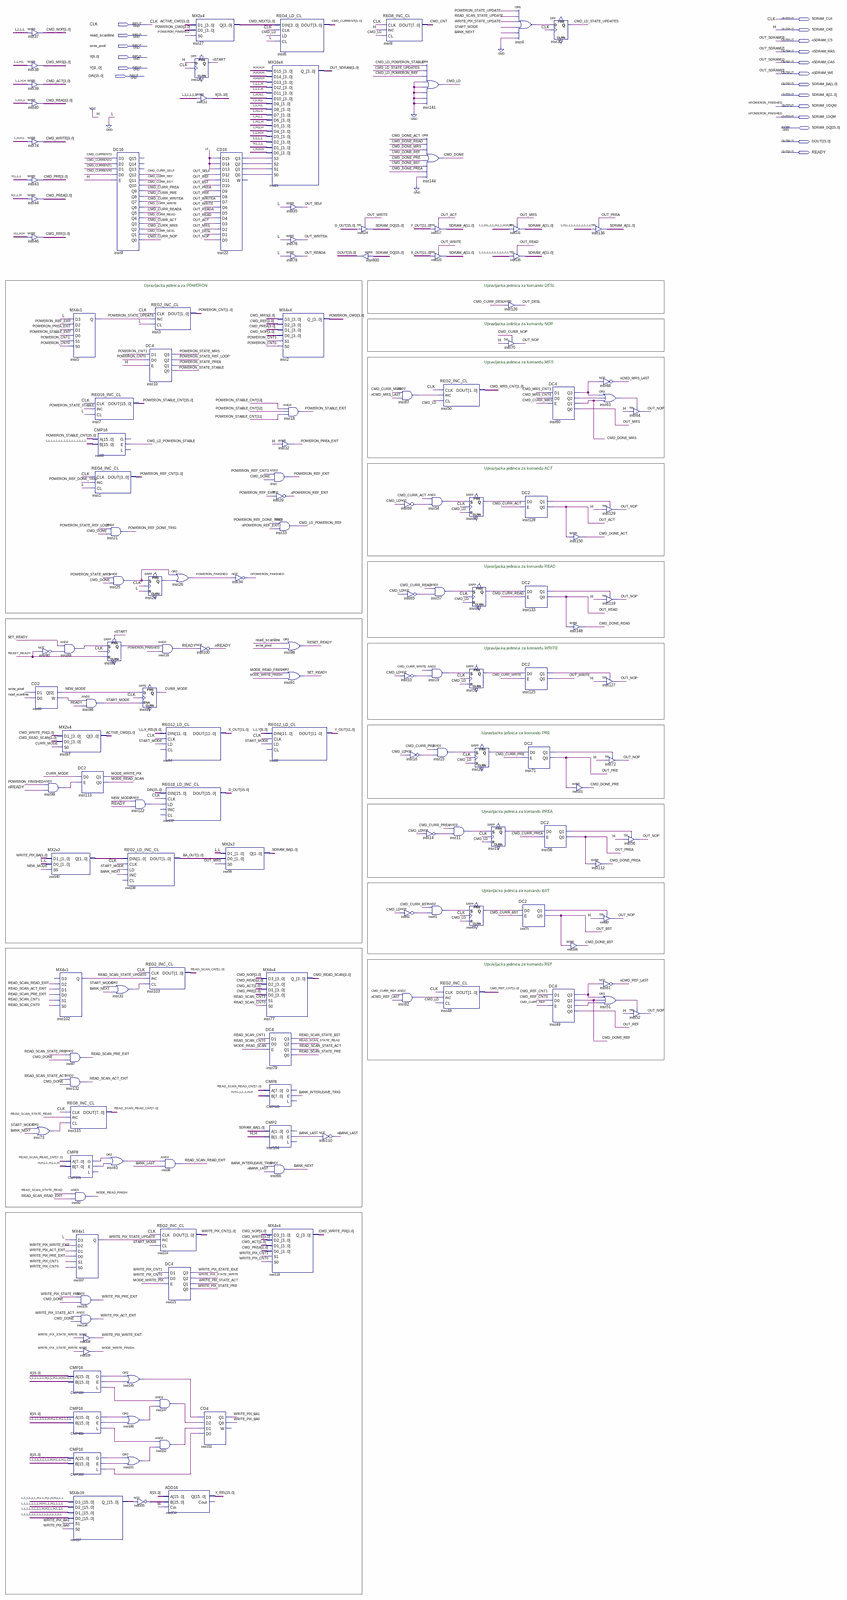
[diagram p0: schematic sheet, whole]
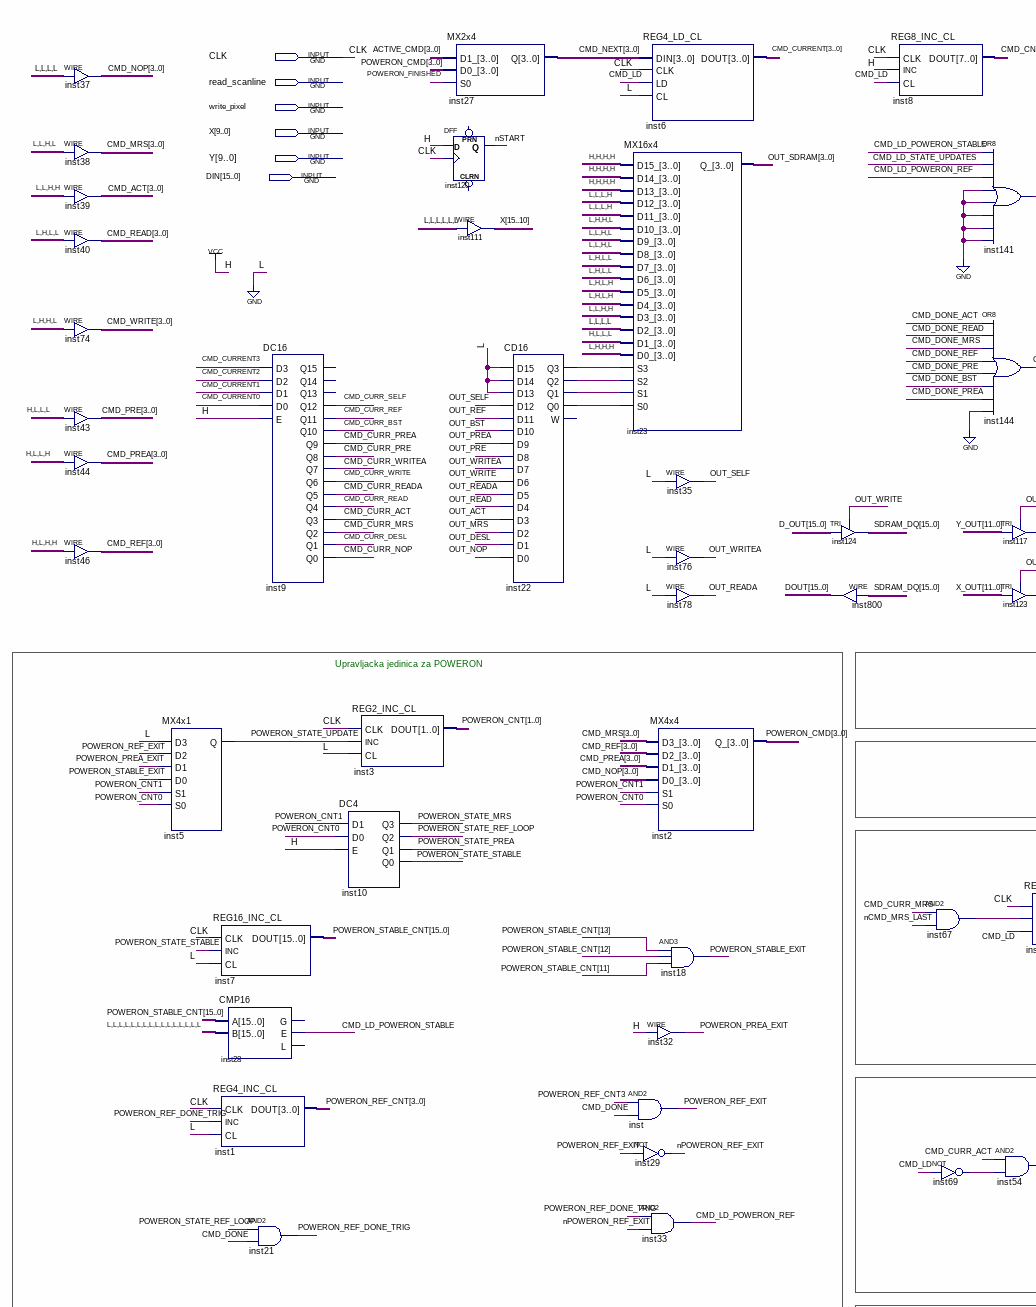
[diagram p1: schematic sheet, upper left part]
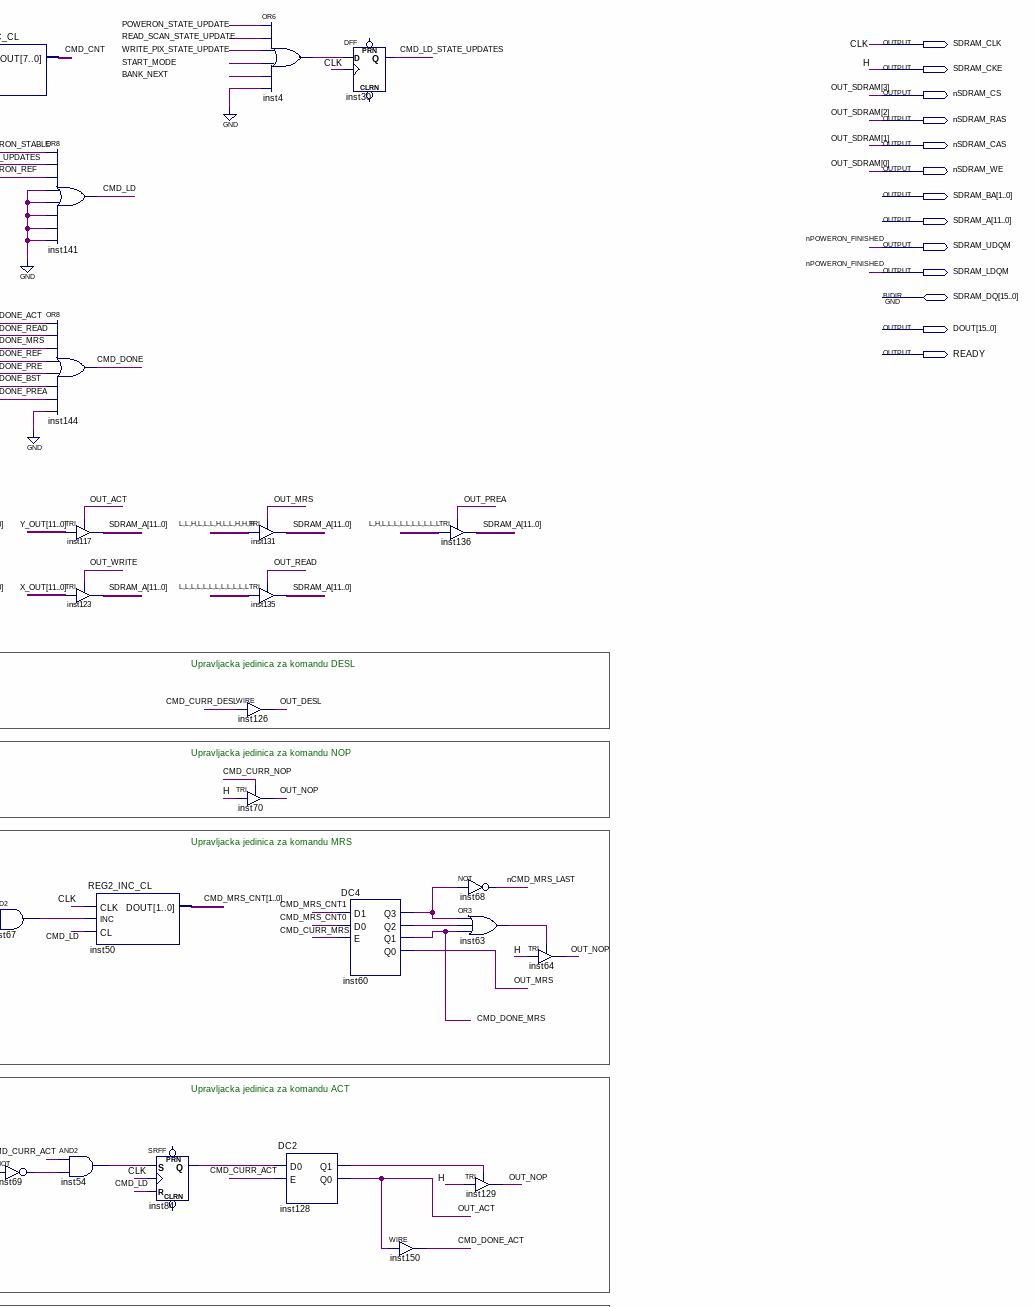
[diagram p2: schematic sheet, upper right part]
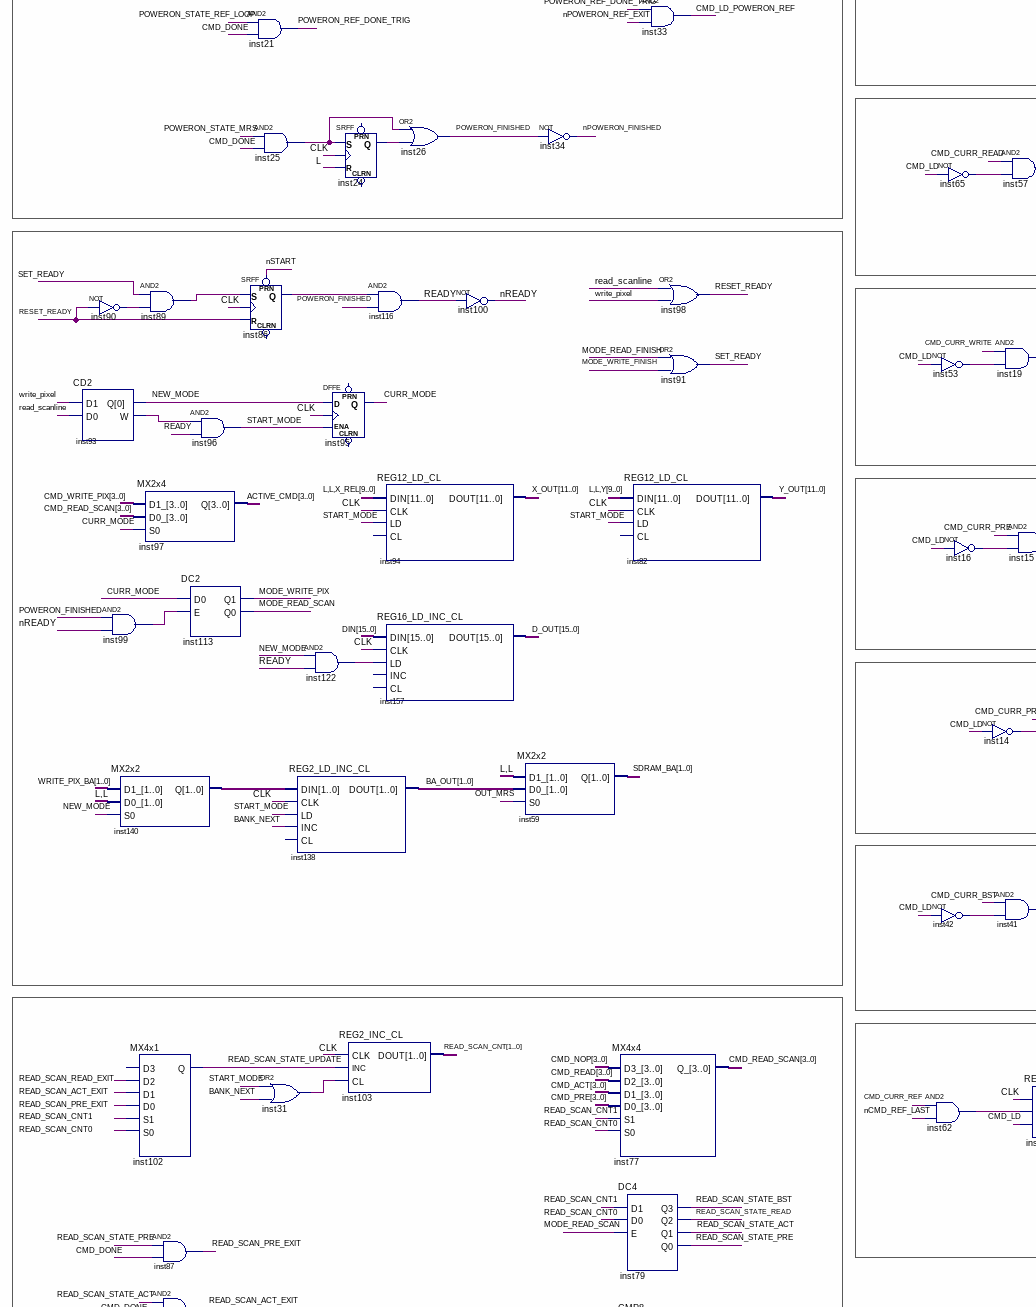
[diagram p3: schematic sheet, middle left part]
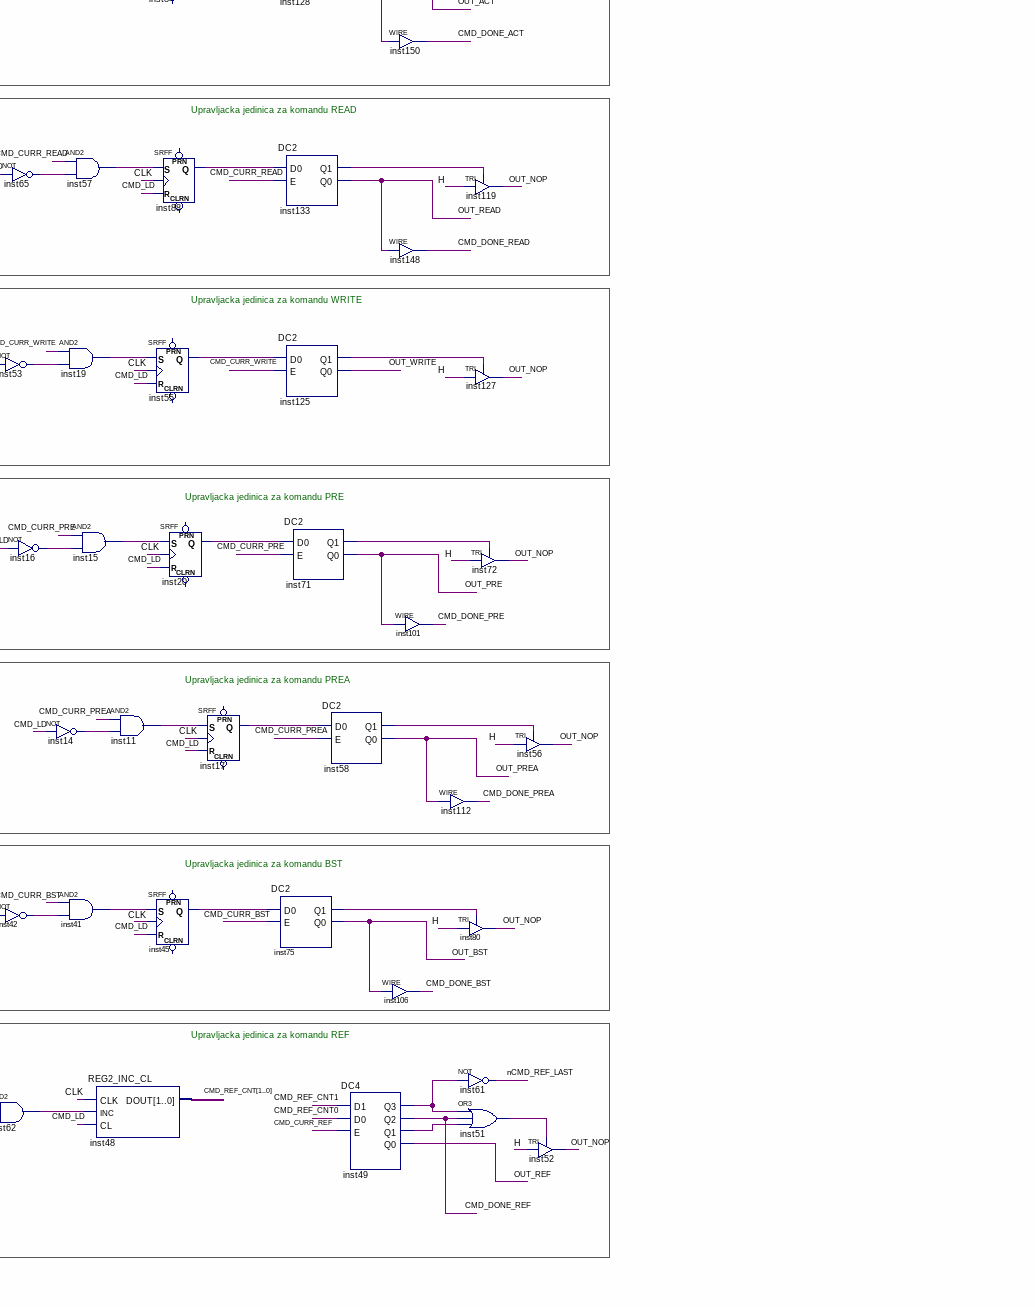
[diagram p4: schematic sheet, middle right part]
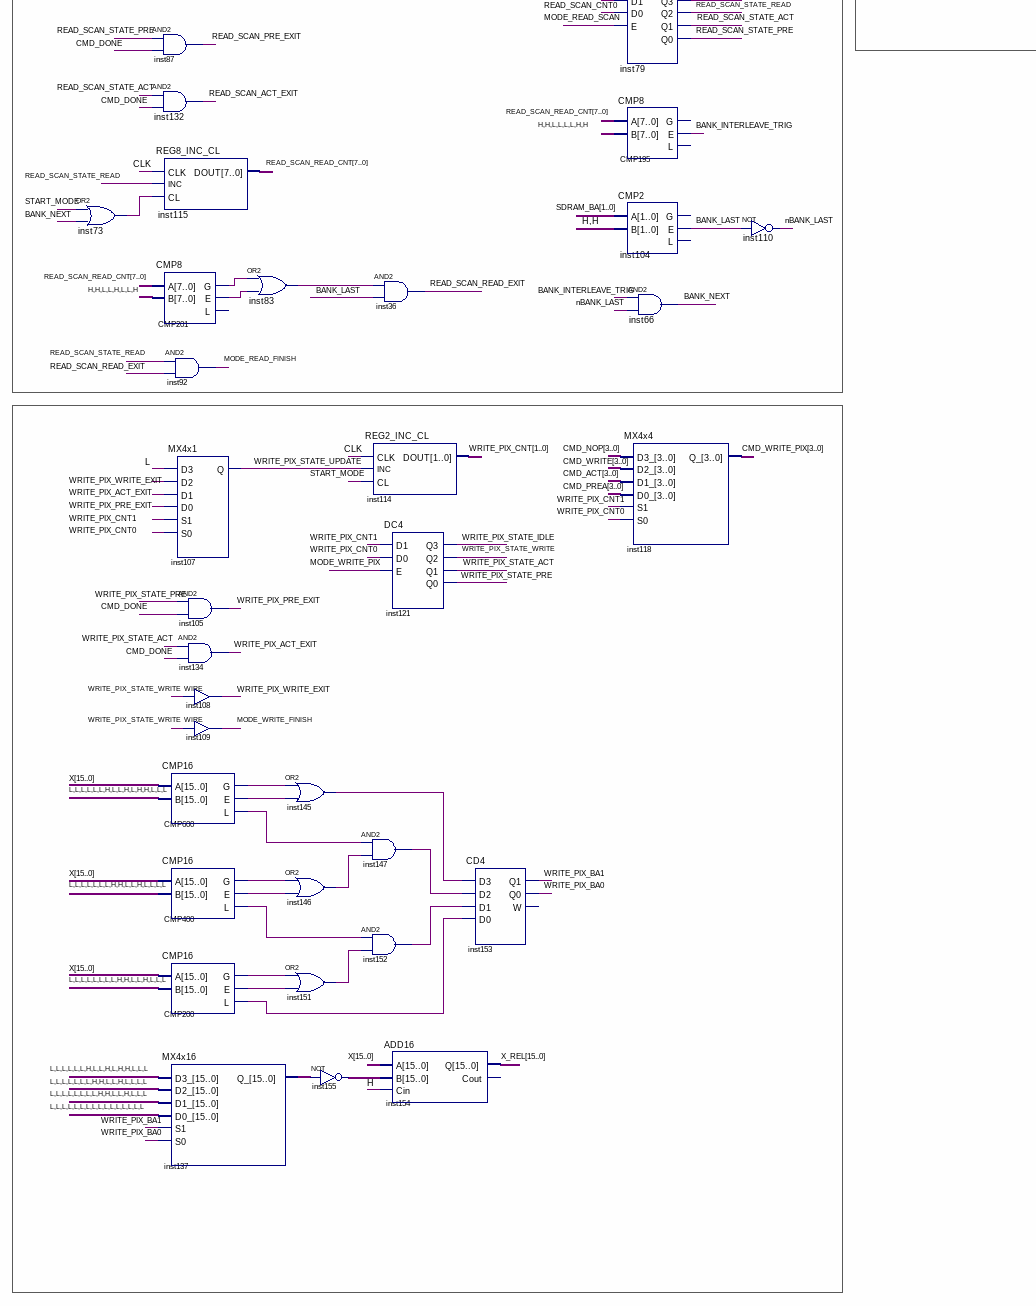
[diagram p5: schematic sheet, lower left part]
// Quartus schematic vram_controller.bdf as structural Verilog: 153 symbols, 19 pins
module vram_controller (
  input  CLK,
  input  read_scanline,
  input  write_pixel,
  input  [15:0] X,
  input  [9:0] Y,
  input  [15:0] DIN,
  inout  [15:0] SDRAM_DQ,
  output SDRAM_CLK,
  output SDRAM_CKE,
  output nSDRAM_CS,
  output nSDRAM_RAS,
  output nSDRAM_CAS,
  output nSDRAM_WE,
  output [1:0] SDRAM_BA,
  output [11:0] SDRAM_A,
  output SDRAM_UDQM,
  output SDRAM_LDQM,
  output [15:0] DOUT,
  output READY
);

  wire BANK_INTERLEAVE_TRIG, BANK_LAST, BANK_NEXT, CMD_CNT, CMD_CURR_ACT, CMD_CURR_BST, CMD_CURR_DESL,
       CMD_CURR_MRS, CMD_CURR_NOP, CMD_CURR_PRE, CMD_CURR_PREA, CMD_CURR_READ, CMD_CURR_READA, CMD_CURR_REF,
       CMD_CURR_SELF, CMD_CURR_WRITE, CMD_CURR_WRITEA, CMD_DONE, CMD_DONE_ACT, CMD_DONE_BST, CMD_DONE_MRS,
       CMD_DONE_PRE, CMD_DONE_PREA, CMD_DONE_READ, CMD_DONE_REF, CMD_LD, CMD_LD_POWERON_REF,
       CMD_LD_POWERON_STABLE, CMD_LD_STATE_UPDATES, CMP200_e, CMP200_g, CMP200_l, CMP201_e, CMP201_g,
       CMP400_e, CMP400_g, CMP400_l, CMP600_e, CMP600_g, CMP600_l, CURR_MODE, inst4_out, inst11_out,
       inst14_out, inst15_out, inst16_out, inst17_q, inst19_out, inst20_q, inst22_q0, inst22_q1, inst22_q2,
       inst22_q3, inst24_q, inst25_out, inst31_out, inst41_out, inst42_out, inst45_q, inst49_q1, inst49_q3,
       inst51_out, inst53_out, inst54_out, inst55_q, inst57_out, inst58_q1, inst60_q2, inst60_q3, inst62_out,
       inst63_out, inst65_out, inst67_out, inst69_out, inst71_q1, inst73_out, inst75_q1, inst83_out,
       inst84_q, inst86_q, inst88_q, inst89_out, inst90_out, inst93_w, inst99_out, inst122_out, inst125_q1,
       inst128_q1, inst133_q1, inst145_out, inst146_out, inst147_out, inst151_out, inst152_out,
       MODE_READ_FINISH, MODE_READ_SCAN, MODE_WRITE_FINISH, MODE_WRITE_PIX, nBANK_LAST, nCMD_MRS_LAST,
       nCMD_REF_LAST, NEW_MODE, nPOWERON_REF_EXIT, nREADY, nSTART, OUT_ACT, OUT_BST, OUT_DESL, OUT_MRS,
       OUT_NOP, OUT_PRE, OUT_PREA, OUT_READ, OUT_READA, OUT_REF, OUT_SELF, OUT_WRITE, OUT_WRITEA,
       POWERON_FINISHED, POWERON_PREA_EXIT, POWERON_REF_DONE_TRIG, POWERON_REF_EXIT, POWERON_STABLE_EXIT,
       POWERON_STATE_MRS, POWERON_STATE_PREA, POWERON_STATE_REF_LOOP, POWERON_STATE_STABLE,
       POWERON_STATE_UPDATE, READ_SCAN_ACT_EXIT, READ_SCAN_PRE_EXIT, READ_SCAN_READ_EXIT,
       READ_SCAN_STATE_ACT, READ_SCAN_STATE_BST, READ_SCAN_STATE_PRE, READ_SCAN_STATE_READ,
       READ_SCAN_STATE_UPDATE, RESET_READY, SET_READY, START_MODE, WRITE_PIX_ACT_EXIT, WRITE_PIX_PRE_EXIT,
       WRITE_PIX_STATE_ACT, WRITE_PIX_STATE_IDLE, WRITE_PIX_STATE_PRE, WRITE_PIX_STATE_UPDATE,
       WRITE_PIX_STATE_WRITE, WRITE_PIX_WRITE_EXIT;
  wire [1:0] BA_OUT, CMD_MRS_CNT, CMD_REF_CNT, inst140_q, POWERON_CNT, READ_SCAN_CNT, WRITE_PIX_BA,
       WRITE_PIX_CNT;
  wire [3:0] ACTIVE_CMD, CMD_ACT, CMD_CURRENT, CMD_MRS, CMD_NEXT, CMD_NOP, CMD_PRE, CMD_PREA, CMD_READ,
       CMD_READ_SCAN, CMD_REF, CMD_WRITE, CMD_WRITE_PIX, POWERON_CMD, POWERON_REF_CNT;
  wire [7:0] READ_SCAN_READ_CNT;
  wire [11:0] X_OUT, Y_OUT;
  wire [15:0] D_OUT, inst137_q_, inst155_out, POWERON_STABLE_CNT, X_REL;

  assign CMD_NOP = 4'b0000;  // WIRE inst37
  assign CMD_MRS = 4'b0010;  // WIRE inst38
  assign CMD_ACT = 4'b0011;  // WIRE inst39
  assign CMD_READ = 4'b0100;  // WIRE inst40
  assign CMD_WRITE = 4'b0110;  // WIRE inst74
  assign CMD_PRE = 4'b1000;  // WIRE inst43
  assign CMD_PREA = 4'b1001;  // WIRE inst44
  assign CMD_REF = 4'b1011;  // WIRE inst46
  not inst90 (inst90_out, RESET_READY);
  CD2 inst93 (.D1(write_pixel), .D0(read_scanline), .Q(NEW_MODE), .W(inst93_w));
  and inst99 (inst99_out, POWERON_FINISHED, nREADY);
  MX2x2 inst140 (.D1_(WRITE_PIX_BA), .D0_(2'b00), .S0(NEW_MODE), .Q(inst140_q));
  or inst73 (inst73_out, START_MODE, BANK_NEXT);
  MX4x1 inst5 (
    .D3(1'b0), .D2(POWERON_REF_EXIT), .D1(POWERON_PREA_EXIT), .D0(POWERON_STABLE_EXIT), .S1(POWERON_CNT[1]),
    .S0(POWERON_CNT[0]), .Q(POWERON_STATE_UPDATE));
  and inst89 (inst89_out, SET_READY, inst90_out);
  MX2x4 inst97 (.D1_(CMD_WRITE_PIX), .D0_(CMD_READ_SCAN), .S0(CURR_MODE), .Q(ACTIVE_CMD));
  MX4x1 inst102 (
    .D2(READ_SCAN_READ_EXIT), .D1(READ_SCAN_ACT_EXIT), .D0(READ_SCAN_PRE_EXIT), .S1(READ_SCAN_CNT[1]),
    .S0(READ_SCAN_CNT[0]), .Q(READ_SCAN_STATE_UPDATE));  // open: D3
  and inst87 (READ_SCAN_PRE_EXIT, READ_SCAN_STATE_PRE, CMD_DONE);
  and inst132 (READ_SCAN_ACT_EXIT, READ_SCAN_STATE_ACT, CMD_DONE);
  REG8_INC_CL inst115 (.CLK(CLK), .INC(READ_SCAN_STATE_READ), .CL(inst73_out), .DOUT(READ_SCAN_READ_CNT));
  CMP8 CMP201 (.A(READ_SCAN_READ_CNT), .B(8'b11001001), .G(CMP201_g), .E(CMP201_e));  // open: L
  CMP16 CMP600 (.A(X), .B(16'b0000001001011000), .G(CMP600_g), .E(CMP600_e), .L(CMP600_l));
  CMP16 CMP400 (.A(X), .B(16'b0000000110010000), .G(CMP400_g), .E(CMP400_e), .L(CMP400_l));
  CMP16 CMP200 (.A(X), .B(16'b0000000011001000), .G(CMP200_g), .E(CMP200_e), .L(CMP200_l));
  MX4x16 inst137 (
    .D3_(16'b0000001001011000), .D2_(16'b0000000110010000), .D1_(16'b0000000011001000), .D0_({16{1'b0}}),
    .S1(WRITE_PIX_BA[1]), .S0(WRITE_PIX_BA[0]), .Q_(inst137_q_));
  REG16_INC_CL inst7 (.CLK(CLK), .INC(POWERON_STATE_STABLE), .CL(1'b0), .DOUT(POWERON_STABLE_CNT));
  REG4_INC_CL inst1 (.CLK(CLK), .INC(POWERON_REF_DONE_TRIG), .CL(1'b0), .DOUT(POWERON_REF_CNT));
  and inst96 (START_MODE, inst93_w, READY);
  DC2 inst113 (.D0(CURR_MODE), .E(inst99_out), .Q1(MODE_WRITE_PIX), .Q0(MODE_READ_SCAN));
  and inst92 (MODE_READ_FINISH, READ_SCAN_STATE_READ, READ_SCAN_READ_EXIT);
  MX4x1 inst107 (
    .D3(1'b0), .D2(WRITE_PIX_WRITE_EXIT), .D1(WRITE_PIX_ACT_EXIT), .D0(WRITE_PIX_PRE_EXIT),
    .S1(WRITE_PIX_CNT[1]), .S0(WRITE_PIX_CNT[0]), .Q(WRITE_PIX_STATE_UPDATE));
  and inst105 (WRITE_PIX_PRE_EXIT, WRITE_PIX_STATE_PRE, CMD_DONE);
  and inst134 (WRITE_PIX_ACT_EXIT, WRITE_PIX_STATE_ACT, CMD_DONE);
  assign WRITE_PIX_WRITE_EXIT = WRITE_PIX_STATE_WRITE;  // WIRE inst108
  assign MODE_WRITE_FINISH = WRITE_PIX_STATE_WRITE;  // WIRE inst109
  DC16 inst9 (
    .D3(CMD_CURRENT[3]), .D2(CMD_CURRENT[2]), .D1(CMD_CURRENT[1]), .D0(CMD_CURRENT[0]), .E(1'b1),
    .Q12(CMD_CURR_SELF), .Q11(CMD_CURR_REF), .Q10(CMD_CURR_BST), .Q9(CMD_CURR_PREA), .Q8(CMD_CURR_PRE),
    .Q7(CMD_CURR_WRITEA), .Q6(CMD_CURR_WRITE), .Q5(CMD_CURR_READA), .Q4(CMD_CURR_READ), .Q3(CMD_CURR_ACT),
    .Q2(CMD_CURR_MRS), .Q1(CMD_CURR_DESL), .Q0(CMD_CURR_NOP));  // open: Q15, Q14, Q13
  CMP16 inst28 (.A(POWERON_STABLE_CNT), .B({16{1'b0}}), .E(CMD_LD_POWERON_STABLE));  // open: G, L
  and inst21 (POWERON_REF_DONE_TRIG, POWERON_STATE_REF_LOOP, CMD_DONE);
  and inst25 (inst25_out, POWERON_STATE_MRS, CMD_DONE);
  SRFF inst86 (.PRN(nSTART), .S(inst89_out), .R(RESET_READY), .CLK(CLK), .Q(inst86_q));  // open: CLRN
  or inst31 (inst31_out, START_MODE, BANK_NEXT);
  or inst83 (inst83_out, CMP201_g, CMP201_e);
  and inst122 (inst122_out, NEW_MODE, READY);
  REG2_LD_INC_CL inst138 (.DIN(inst140_q), .CLK(CLK), .LD(START_MODE), .INC(BANK_NEXT), .DOUT(BA_OUT));  // open: CL
  or inst145 (inst145_out, CMP600_g, CMP600_e);
  or inst146 (inst146_out, CMP400_g, CMP400_e);
  or inst151 (inst151_out, CMP200_g, CMP200_e);
  assign inst155_out = ~inst137_q_;  // NOT inst155, 16 bits wide
  REG2_INC_CL inst3 (.CLK(CLK), .INC(POWERON_STATE_UPDATE), .CL(1'b0), .DOUT(POWERON_CNT));
  DC4 inst10 (
    .D1(POWERON_CNT[1]), .D0(POWERON_CNT[0]), .E(1'b1), .Q3(POWERON_STATE_MRS), .Q2(POWERON_STATE_REF_LOOP),
    .Q1(POWERON_STATE_PREA), .Q0(POWERON_STATE_STABLE));
  SRFF inst24 (.S(inst25_out), .R(1'b0), .CLK(CLK), .Q(inst24_q));  // open: PRN, CLRN
  DFFE inst95 (.D(NEW_MODE), .CLK(CLK), .ENA(START_MODE), .Q(CURR_MODE));  // open: PRN, CLRN
  REG2_INC_CL inst103 (.CLK(CLK), .INC(READ_SCAN_STATE_UPDATE), .CL(inst31_out), .DOUT(READ_SCAN_CNT));
  REG2_INC_CL inst114 (.CLK(CLK), .INC(WRITE_PIX_STATE_UPDATE), .CL(START_MODE), .DOUT(WRITE_PIX_CNT));
  and inst147 (inst147_out, CMP600_l, inst146_out);
  and inst152 (inst152_out, CMP400_l, inst151_out);
  or inst26 (POWERON_FINISHED, inst25_out, inst24_q);
  and inst116 (READY, inst86_q, POWERON_FINISHED);
  REG12_LD_CL inst94 (.DIN({2'b00, X_REL[9:0]}), .CLK(CLK), .LD(START_MODE), .DOUT(X_OUT));  // open: CL
  REG16_LD_INC_CL inst157 (.DIN(DIN), .CLK(CLK), .LD(inst122_out), .DOUT(D_OUT));  // open: INC, CL
  and inst36 (READ_SCAN_READ_EXIT, inst83_out, BANK_LAST);
  DC4 inst121 (
    .D1(WRITE_PIX_CNT[1]), .D0(WRITE_PIX_CNT[0]), .E(MODE_WRITE_PIX), .Q3(WRITE_PIX_STATE_IDLE),
    .Q2(WRITE_PIX_STATE_WRITE), .Q1(WRITE_PIX_STATE_ACT), .Q0(WRITE_PIX_STATE_PRE));
  ADD16 inst154 (.A(X), .B(inst155_out), .Cin(1'b1), .Q(X_REL));  // open: Cout
  MX2x4 inst27 (.D1_(ACTIVE_CMD), .D0_(POWERON_CMD), .S0(POWERON_FINISHED), .Q(CMD_NEXT));
  DFF inst120 (.CLK(CLK), .D(1'b1), .Q(nSTART));  // open: CLRN, PRN
  assign X[15:10] = {6{1'b0}};  // WIRE inst111
  not inst100 (nREADY, READY);
  CD4 inst153 (
    .D3(inst145_out), .D2(inst147_out), .D1(inst152_out), .D0(CMP200_l), .Q1(WRITE_PIX_BA[1]),
    .Q0(WRITE_PIX_BA[0]));  // open: W
  CD16 inst22 (
    .D15(1'b0), .D14(1'b0), .D13(1'b0), .D12(OUT_SELF), .D11(OUT_REF), .D10(OUT_BST), .D9(OUT_PREA),
    .D8(OUT_PRE), .D7(OUT_WRITEA), .D6(OUT_WRITE), .D5(OUT_READA), .D4(OUT_READ), .D3(OUT_ACT), .D2(OUT_MRS),
    .D1(OUT_DESL), .D0(OUT_NOP), .Q3(inst22_q3), .Q2(inst22_q2), .Q1(inst22_q1), .Q0(inst22_q0));  // open: W
  MX2x2 inst59 (.D1_(2'b00), .D0_(BA_OUT), .S0(OUT_MRS), .Q(SDRAM_BA));
  not inst34 (SDRAM_LDQM, POWERON_FINISHED);
  MX4x4 inst77 (
    .D3_(CMD_NOP), .D2_(CMD_READ), .D1_(CMD_ACT), .D0_(CMD_PRE), .S1(READ_SCAN_CNT[1]),
    .S0(READ_SCAN_CNT[0]), .Q_(CMD_READ_SCAN));
  DC4 inst79 (
    .D1(READ_SCAN_CNT[1]), .D0(READ_SCAN_CNT[0]), .E(MODE_READ_SCAN), .Q3(READ_SCAN_STATE_BST),
    .Q2(READ_SCAN_STATE_READ), .Q1(READ_SCAN_STATE_ACT), .Q0(READ_SCAN_STATE_PRE));
  CMP8 CMP195 (.A(READ_SCAN_READ_CNT), .B(8'b11000011), .E(BANK_INTERLEAVE_TRIG));  // open: G, L
  CMP2 inst104 (.A(SDRAM_BA), .B(2'b11), .E(BANK_LAST));  // open: G, L
  REG4_LD_CL inst6 (.DIN(CMD_NEXT), .CLK(CLK), .LD(CMD_LD), .CL(1'b0), .DOUT(CMD_CURRENT));
  MX16x4 inst23 (
    .D15_(4'b1111), .D14_(4'b1111), .D13_(4'b1111), .D12_(4'b0001), .D11_(4'b0001), .D10_(4'b0110),
    .D9_(4'b0010), .D8_(4'b0010), .D7_(4'b0100), .D6_(4'b0100), .D5_(4'b0101), .D4_(4'b0101), .D3_(4'b0011),
    .D2_(4'b0000), .D1_(4'b1000), .D0_(4'b0111), .S3(inst22_q3), .S2(inst22_q2), .S1(inst22_q1),
    .S0(inst22_q0), .Q_({nSDRAM_CS, nSDRAM_RAS, nSDRAM_CAS, nSDRAM_WE}));
  assign OUT_SELF = 1'b0;  // WIRE inst35
  assign OUT_WRITEA = 1'b0;  // WIRE inst76
  assign OUT_READA = 1'b0;  // WIRE inst78
  MX4x4 inst2 (
    .D3_(CMD_MRS), .D2_(CMD_REF), .D1_(CMD_PREA), .D0_(CMD_NOP), .S1(POWERON_CNT[1]), .S0(POWERON_CNT[0]),
    .Q_(POWERON_CMD));
  and inst18 (POWERON_STABLE_EXIT, POWERON_STABLE_CNT[13], POWERON_STABLE_CNT[12], POWERON_STABLE_CNT[11]);
  assign POWERON_PREA_EXIT = 1'b1;  // WIRE inst32
  and inst (POWERON_REF_EXIT, POWERON_REF_CNT[3], CMD_DONE);
  not inst29 (nPOWERON_REF_EXIT, POWERON_REF_EXIT);
  and inst33 (CMD_LD_POWERON_REF, POWERON_REF_DONE_TRIG, nPOWERON_REF_EXIT);
  or inst98 (RESET_READY, read_scanline, write_pixel);
  or inst91 (SET_READY, MODE_READ_FINISH, MODE_WRITE_FINISH);
  REG12_LD_CL inst82 (.DIN({2'b00, Y}), .CLK(CLK), .LD(START_MODE), .DOUT(Y_OUT));  // open: CL
  and inst66 (BANK_NEXT, BANK_INTERLEAVE_TRIG, nBANK_LAST);
  MX4x4 inst118 (
    .D3_(CMD_NOP), .D2_(CMD_WRITE), .D1_(CMD_ACT), .D0_(CMD_PREA), .S1(WRITE_PIX_CNT[1]),
    .S0(WRITE_PIX_CNT[0]), .Q_(CMD_WRITE_PIX));
  not inst110 (nBANK_LAST, BANK_LAST);
  TRI inst124[15:0] (.IN(D_OUT), .OE(OUT_WRITE), .OUT(SDRAM_DQ));
  assign DOUT = SDRAM_DQ;  // WIRE inst800
  REG8_INC_CL inst8 (.CLK(CLK), .INC(1'b1), .CL(CMD_LD), .DOUT(CMD_CNT));
  and inst67 (inst67_out, CMD_CURR_MRS, nCMD_MRS_LAST);
  not inst69 (inst69_out, CMD_LD);
  not inst65 (inst65_out, CMD_LD);
  not inst53 (inst53_out, CMD_LD);
  not inst16 (inst16_out, CMD_LD);
  not inst42 (inst42_out, CMD_LD);
  and inst62 (inst62_out, CMD_CURR_REF, nCMD_REF_LAST);
  or inst141 (CMD_LD, CMD_LD_POWERON_STABLE, CMD_LD_STATE_UPDATES, CMD_LD_POWERON_REF, 1'b0, 1'b0, 1'b0, 1'b0, 1'b0);
  or inst144 (CMD_DONE, CMD_DONE_ACT, CMD_DONE_READ, CMD_DONE_MRS, CMD_DONE_REF, CMD_DONE_PRE, CMD_DONE_BST, CMD_DONE_PREA, 1'b0);
  TRI inst117[11:0] (.IN(Y_OUT), .OE(OUT_ACT), .OUT(SDRAM_A));
  TRI inst123[11:0] (.IN(X_OUT), .OE(OUT_WRITE), .OUT(SDRAM_A));
  REG2_INC_CL inst50 (.CLK(CLK), .INC(inst67_out), .CL(CMD_LD), .DOUT(CMD_MRS_CNT));
  and inst54 (inst54_out, CMD_CURR_ACT, inst69_out);
  and inst57 (inst57_out, CMD_CURR_READ, inst65_out);
  and inst19 (inst19_out, CMD_CURR_WRITE, inst53_out);
  and inst15 (inst15_out, CMD_CURR_PRE, inst16_out);
  not inst14 (inst14_out, CMD_LD);
  and inst41 (inst41_out, CMD_CURR_BST, inst42_out);
  REG2_INC_CL inst48 (.CLK(CLK), .INC(inst62_out), .CL(CMD_LD), .DOUT(CMD_REF_CNT));
  and inst11 (inst11_out, CMD_CURR_PREA, inst14_out);
  SRFF inst84 (.S(inst54_out), .R(CMD_LD), .CLK(CLK), .Q(inst84_q));  // open: PRN, CLRN
  SRFF inst88 (.S(inst57_out), .R(CMD_LD), .CLK(CLK), .Q(inst88_q));  // open: PRN, CLRN
  SRFF inst55 (.S(inst19_out), .R(CMD_LD), .CLK(CLK), .Q(inst55_q));  // open: PRN, CLRN
  SRFF inst20 (.S(inst15_out), .R(CMD_LD), .CLK(CLK), .Q(inst20_q));  // open: PRN, CLRN
  SRFF inst45 (.S(inst41_out), .R(CMD_LD), .CLK(CLK), .Q(inst45_q));  // open: PRN, CLRN
  assign OUT_DESL = CMD_CURR_DESL;  // WIRE inst126
  TRI inst70 (.IN(1'b1), .OE(CMD_CURR_NOP), .OUT(OUT_NOP));
  SRFF inst17 (.S(inst11_out), .R(CMD_LD), .CLK(CLK), .Q(inst17_q));  // open: PRN, CLRN
  or inst4 (inst4_out, POWERON_STATE_UPDATE, READ_SCAN_STATE_UPDATE, WRITE_PIX_STATE_UPDATE, START_MODE, BANK_NEXT, 1'b0);
  TRI inst131[11:0] (.IN(12'b001000100111), .OE(OUT_MRS), .OUT(SDRAM_A));
  TRI inst135[11:0] (.IN({12{1'b0}}), .OE(OUT_READ), .OUT(SDRAM_A));
  DC2 inst128 (.D0(inst84_q), .E(CMD_CURR_ACT), .Q1(inst128_q1), .Q0(OUT_ACT));
  DC2 inst133 (.D0(inst88_q), .E(CMD_CURR_READ), .Q1(inst133_q1), .Q0(OUT_READ));
  DC2 inst125 (.D0(inst55_q), .E(CMD_CURR_WRITE), .Q1(inst125_q1), .Q0(OUT_WRITE));
  DC2 inst71 (.D0(inst20_q), .E(CMD_CURR_PRE), .Q1(inst71_q1), .Q0(OUT_PRE));
  DC2 inst75 (.D0(inst45_q), .E(CMD_CURR_BST), .Q1(inst75_q1), .Q0(OUT_BST));
  DC4 inst60 (
    .D1(CMD_MRS_CNT[1]), .D0(CMD_MRS_CNT[0]), .E(CMD_CURR_MRS), .Q3(inst60_q3), .Q2(inst60_q2),
    .Q1(CMD_DONE_MRS), .Q0(OUT_MRS));
  DC2 inst58 (.D0(inst17_q), .E(CMD_CURR_PREA), .Q1(inst58_q1), .Q0(OUT_PREA));
  DC4 inst49 (
    .D1(CMD_REF_CNT[1]), .D0(CMD_REF_CNT[0]), .E(CMD_CURR_REF), .Q3(inst49_q3), .Q2(CMD_DONE_REF),
    .Q1(inst49_q1), .Q0(OUT_REF));
  DFF inst30 (.CLK(CLK), .D(inst4_out), .Q(CMD_LD_STATE_UPDATES));  // open: CLRN, PRN
  assign CMD_DONE_ACT = OUT_ACT;  // WIRE inst150
  assign CMD_DONE_READ = OUT_READ;  // WIRE inst148
  assign CMD_DONE_BST = OUT_BST;  // WIRE inst106
  TRI inst136[11:0] (.IN(12'b010000000000), .OE(OUT_PREA), .OUT(SDRAM_A));
  assign CMD_DONE_PRE = OUT_PRE;  // WIRE inst101
  assign CMD_DONE_PREA = OUT_PREA;  // WIRE inst112
  not inst68 (nCMD_MRS_LAST, inst60_q3);
  or inst63 (inst63_out, inst60_q3, inst60_q2, CMD_DONE_MRS);
  TRI inst129 (.IN(1'b1), .OE(inst128_q1), .OUT(OUT_NOP));
  TRI inst119 (.IN(1'b1), .OE(inst133_q1), .OUT(OUT_NOP));
  TRI inst127 (.IN(1'b1), .OE(inst125_q1), .OUT(OUT_NOP));
  TRI inst72 (.IN(1'b1), .OE(inst71_q1), .OUT(OUT_NOP));
  TRI inst80 (.IN(1'b1), .OE(inst75_q1), .OUT(OUT_NOP));
  not inst61 (nCMD_REF_LAST, inst49_q3);
  or inst51 (inst51_out, inst49_q3, CMD_DONE_REF, inst49_q1);
  TRI inst64 (.IN(1'b1), .OE(inst63_out), .OUT(OUT_NOP));
  TRI inst56 (.IN(1'b1), .OE(inst58_q1), .OUT(OUT_NOP));
  TRI inst52 (.IN(1'b1), .OE(inst51_out), .OUT(OUT_NOP));

  assign SDRAM_CKE = 1'b1;
  assign SDRAM_CLK = CLK;
  assign SDRAM_UDQM = SDRAM_LDQM;

  // Other names for the same wires on the sheet: nPOWERON_FINISHED = SDRAM_LDQM;
  //   OUT_SDRAM[3:0] = {nSDRAM_CS, nSDRAM_RAS, nSDRAM_CAS, nSDRAM_WE}

  // Notes on the sheet:
  //   Upravljacka jedinica za POWERON
  //   Upravljacka jedinica za komandu DESL
  //   Upravljacka jedinica za komandu NOP
  //   Upravljacka jedinica za komandu MRS
  //   Upravljacka jedinica za komandu ACT
  //   Upravljacka jedinica za komandu READ
  //   Upravljacka jedinica za komandu WRITE
  //   Upravljacka jedinica za komandu PRE
  //   Upravljacka jedinica za komandu PREA
  //   Upravljacka jedinica za komandu BST
  //   Upravljacka jedinica za komandu REF
endmodule
